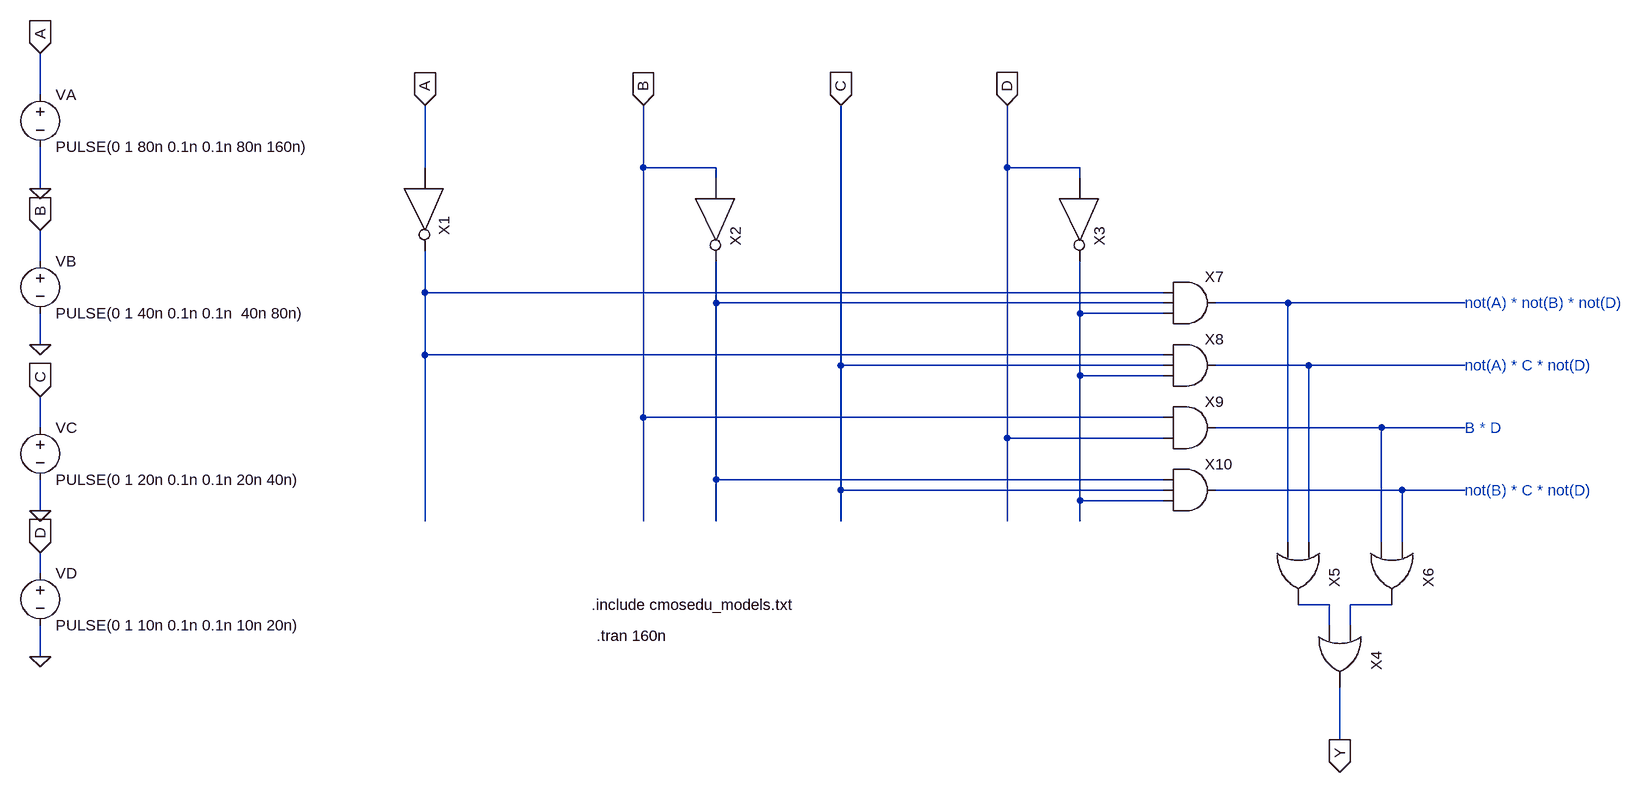
[diagram p0: schematic Circuit.asc]
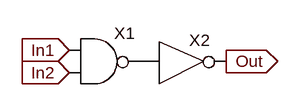
[diagram p1: sub-circuit and2.asc]
Circuit.asc, the LTspice schematic file:
Version 4
SHEET 1 1932 680
WIRE -544 -416 -544 -480
WIRE 48 -304 48 -400
WIRE 384 -304 384 -400
WIRE 496 -304 384 -304
WIRE 944 -304 944 -400
WIRE 1056 -304 944 -304
WIRE 496 -288 496 -304
WIRE 1056 -288 1056 -304
WIRE -544 -272 -544 -336
WIRE -544 -160 -544 -208
WIRE 48 -112 48 -176
WIRE 1184 -112 48 -112
WIRE 496 -96 496 -160
WIRE 1184 -96 496 -96
WIRE 1376 -96 1264 -96
WIRE 1648 -96 1376 -96
WIRE 1056 -80 1056 -160
WIRE 1184 -80 1056 -80
WIRE -544 -32 -544 -80
WIRE 48 -16 48 -112
WIRE 1184 -16 48 -16
WIRE 688 0 688 -400
WIRE 1184 0 688 0
WIRE 1408 0 1264 0
WIRE 1648 0 1408 0
WIRE 1056 16 1056 -80
WIRE 1184 16 1056 16
WIRE 384 80 384 -304
WIRE 1184 80 384 80
WIRE -544 96 -544 48
WIRE 1520 96 1264 96
WIRE 1648 96 1520 96
WIRE 944 112 944 -304
WIRE 1184 112 944 112
WIRE 496 176 496 -96
WIRE 1184 176 496 176
WIRE 688 192 688 0
WIRE 1184 192 688 192
WIRE 1552 192 1264 192
WIRE 1648 192 1552 192
WIRE 1056 208 1056 16
WIRE 1184 208 1056 208
WIRE -544 224 -544 176
WIRE 48 240 48 -16
WIRE 384 240 384 80
WIRE 496 240 496 176
WIRE 688 240 688 192
WIRE 944 240 944 112
WIRE 1056 240 1056 208
WIRE 1376 272 1376 -96
WIRE 1408 272 1408 0
WIRE 1520 272 1520 96
WIRE 1552 272 1552 192
WIRE -544 320 -544 288
WIRE 1440 368 1392 368
WIRE 1536 368 1472 368
WIRE 1440 400 1440 368
WIRE 1472 400 1472 368
WIRE -544 448 -544 400
WIRE 1456 576 1456 496
FLAG 48 -400 A
IOPIN 48 -400 In
FLAG 384 -400 B
IOPIN 384 -400 In
FLAG 688 -400 C
IOPIN 688 -400 In
FLAG 944 -400 D
IOPIN 944 -400 In
FLAG 1456 576 Y
IOPIN 1456 576 Out
FLAG -544 -272 0
FLAG -544 -32 0
FLAG -544 224 0
FLAG -544 448 0
FLAG -544 -480 A
IOPIN -544 -480 In
FLAG -544 -208 B
IOPIN -544 -208 In
FLAG -544 48 C
IOPIN -544 48 In
FLAG -544 288 D
IOPIN -544 288 In
SYMBOL NOT 80 -272 R90
SYMATTR InstName X1
SYMBOL NOT 528 -256 R90
SYMATTR InstName X2
SYMBOL NOT 1088 -256 R90
SYMATTR InstName X3
SYMBOL OR2 1520 448 R90
SYMATTR InstName X4
SYMBOL OR2 1456 320 R90
SYMATTR InstName X5
SYMBOL OR2 1600 320 R90
SYMATTR InstName X6
SYMBOL AND3 1232 -160 R0
SYMATTR InstName X7
SYMBOL AND3 1232 -64 R0
SYMATTR InstName X8
SYMBOL AND3 1232 128 R0
SYMATTR InstName X10
SYMBOL AND2 1232 32 R0
SYMATTR InstName X9
SYMBOL voltage -544 -432 R0
WINDOW 123 0 0 Left 0
WINDOW 39 0 0 Left 0
SYMATTR InstName VA
SYMATTR Value PULSE(0 1 80n 0.1n 0.1n 80n 160n)
SYMBOL voltage -544 -176 R0
SYMATTR InstName VB
SYMATTR Value PULSE(0 1 40n 0.1n 0.1n  40n 80n)
SYMBOL voltage -544 80 R0
SYMATTR InstName VC
SYMATTR Value PULSE(0 1 20n 0.1n 0.1n 20n 40n)
SYMBOL voltage -544 304 R0
SYMATTR InstName VD
SYMATTR Value PULSE(0 1 10n 0.1n 0.1n 10n 20n)
TEXT 304 368 Left 2 !.include cmosedu_models.txt
TEXT 1648 -96 Left 2 ;not(A) * not(B) * not(D)
TEXT 1648 0 Left 2 ;not(A) * C * not(D)
TEXT 1648 96 Left 2 ;B * D
TEXT 1648 192 Left 2 ;not(B) * C * not(D)
TEXT 312 416 Left 2 !.tran 160n

and2.asc, the sub-circuit schematic file:
Version 4
SHEET 1 1136 680
FLAG 592 272 Out
IOPIN 592 272 Out
FLAG 368 256 In1
IOPIN 368 256 In
FLAG 368 288 In2
IOPIN 368 288 In
SYMBOL NAND2 416 208 R0
SYMATTR InstName X1
SYMBOL NOT 496 240 R0
SYMATTR InstName X2

The netlist it stands for:
* Circuit.asc
XX1 A N001 NOT  ; pins In Out
XX2 B N002 NOT  ; pins In Out
XX3 D N004 NOT  ; pins In Out
XX4 N009 N008 Y OR2  ; pins In1 In2 Out
XX5 N005 N003 N008 OR2  ; pins In1 In2 Out
XX6 N007 N006 N009 OR2  ; pins In1 In2 Out
XX7 N001 N004 N003 N002 AND3  ; pins In1 In3 Out In2
XX8 N001 N004 N005 C AND3  ; pins In1 In3 Out In2
XX10 N002 N004 N007 C AND3  ; pins In1 In3 Out In2
XX9 B D N006 and2
VA A 0 PULSE(0 1 80n 0.1n 0.1n 80n 160n)
VB B 0 PULSE(0 1 40n 0.1n 0.1n  40n 80n)
VC C 0 PULSE(0 1 20n 0.1n 0.1n 20n 40n)
VD D 0 PULSE(0 1 10n 0.1n 0.1n 10n 20n)

* block symbol definitions
.subckt and2 In1 In2 Out
XX1 In1 In2 P001 NAND2  ; pins In1 In2 Out
XX2 P001 Out NOT  ; pins In Out
.ends and2

.include cmosedu_models.txt
* not(A) * not(B) * not(D)
* not(A) * C * not(D)
* B * D
* not(B) * C * not(D)
.tran 160n
.backanno
.end

* Results of the author's LTspice run, read from the files saved beside the schematic
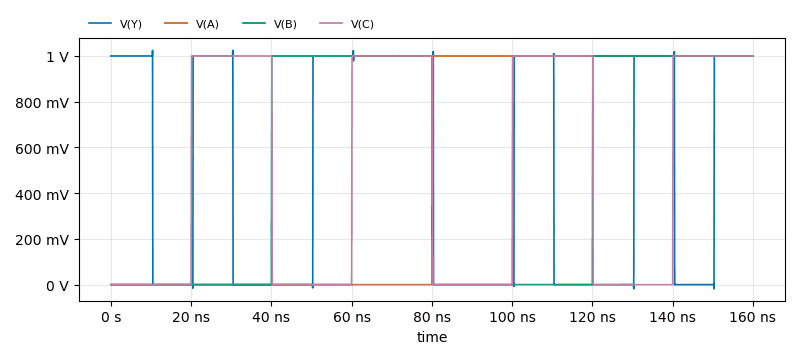
[diagram p2: Transient Analysis of Circuit.asc, plotted from the saved traces]
* Transient Analysis, 1 run:
*   V(Y): min -18.21 mV, max 1.024 V, average 500.8 mV, rms 707.3 mV, last 1 V
*   V(A): min 0 V, max 1 V, average 499.7 mV, rms 706.8 mV, last 1 V
*   V(B): min 0 V, max 1 V, average 500.3 mV, rms 707.1 mV, last 1 V
*   V(C): min 0 V, max 1 V, average 501.6 mV, rms 707.7 mV, last 1 V